# Altium project bdk2m_comm.PrjPcb
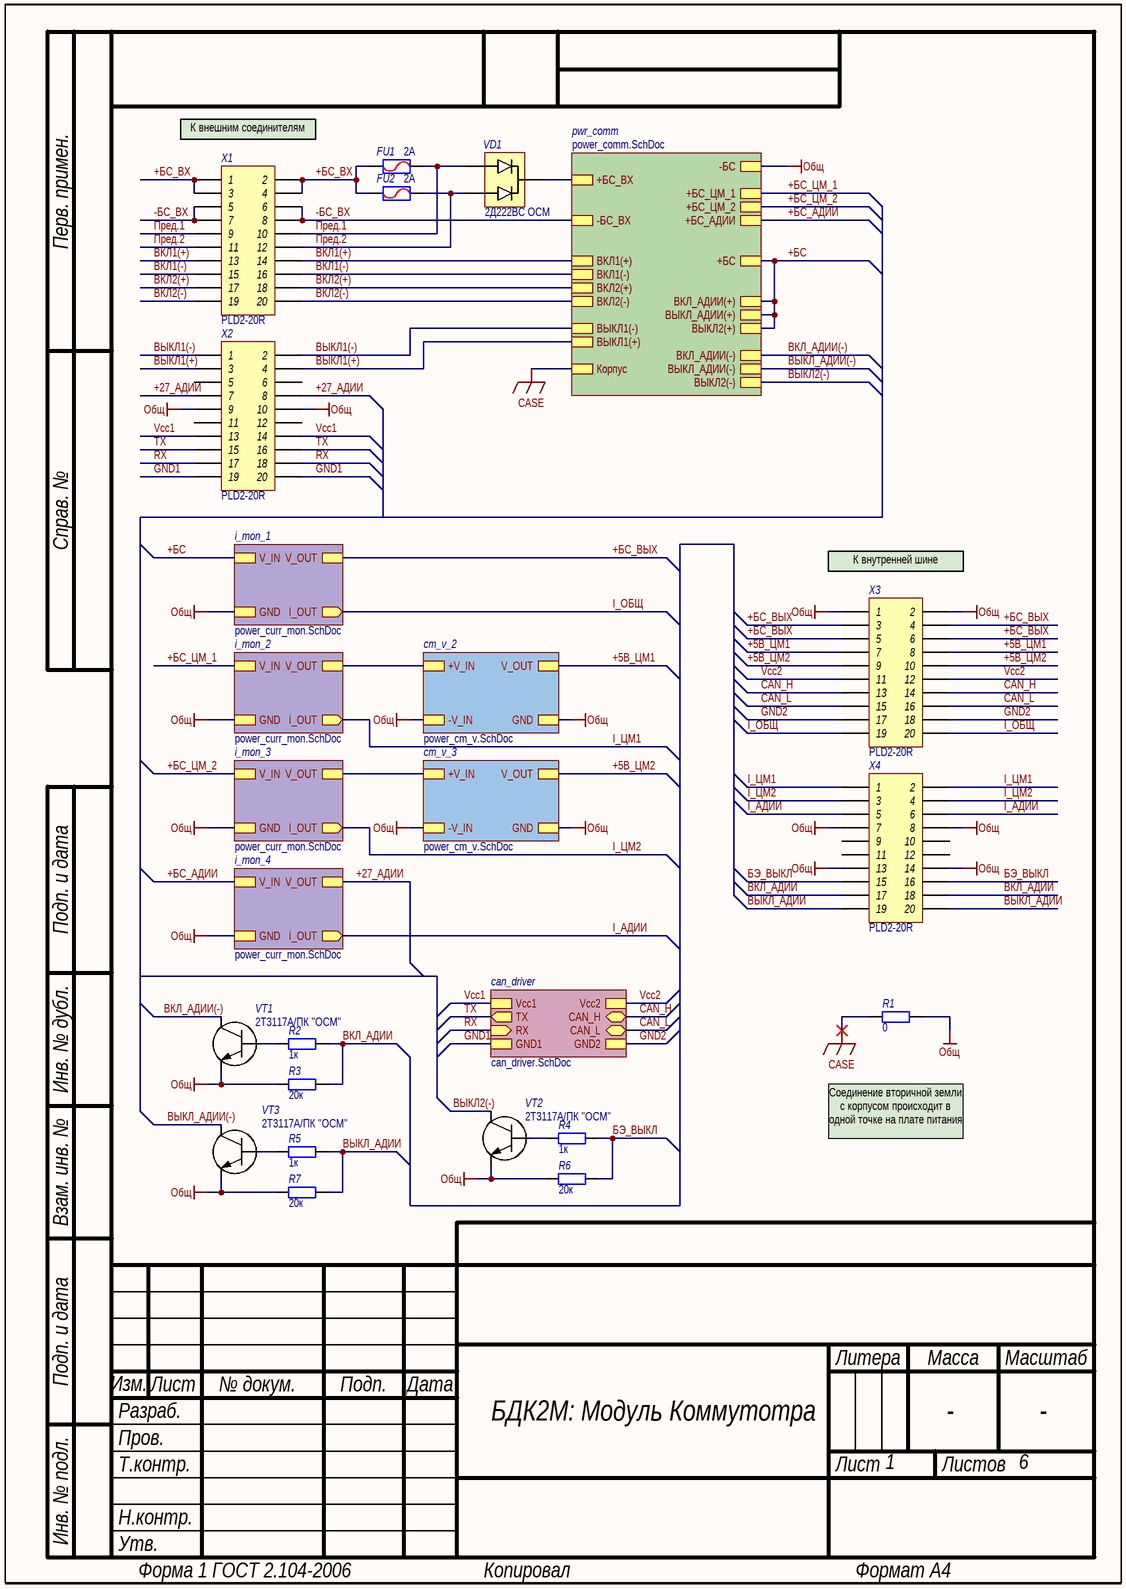
[diagram p0: bdk2m_comm.SchDoc]
GlobalOrganizationName: НГУ; GlobalProjectName: БДК2М: Модуль Коммутотра; GlobalProjectNumber: ЮМП.250.212.01; GlobalProjectRevision: #1.0; Норм.Контр.: Задорожная; Проверил: Прокопьев; Разработал: Стюф; Утвердил: Прокопьев
6 sheets, 91 parts. Net scope: hierarchical (ports join the sheet entries above them; power ports are global).
Board file: bdk2m_comm.PcbDoc
Sheets:
  bdk2m_comm.SchDoc
    pwr_comm = power_comm.SchDoc
      p_f = power_filter.SchDoc
    cm_v_2 = power_cm_v.SchDoc
    i_mon_2 = power_curr_mon.SchDoc
    i_mon_3 = power_curr_mon.SchDoc
    i_mon_1 = power_curr_mon.SchDoc
    i_mon_4 = power_curr_mon.SchDoc
    cm_v_3 = power_cm_v.SchDoc
    can_driver = can_driver.SchDoc

## Sheet bdk2m_comm.SchDoc: =GlobalProjectName
size 209 x 297 mm; ApprovedBy: Прокопьев; CheckedBy: Прокопьев; Author: Стюф; Organization: НГУ; DocumentNumber: ЮМП.250.212.01 Э3; Revision: #1.0; SheetNumber: 1; SheetTotal: 6; PageSetup: Record=PageOptions|CenterHorizontal=True|CenterVertical=True|PrintScale=1.00|XCorrection=1.00|YCorrection=1.00|PrintKind=1|BorderSize=5000000|LeftOffset=0|BottomOffset=0|Orientation=2|PaperLength=1000|PaperWidth=1000|Scale=100|PaperSource=15|PrintQuality=1200|MediaType=1|DitherType=10|PaperKind=A3|PrintScaleMode=1; Weight: -; ScaleFactor: -; NormInspection: Задорожная; FirstApplication: ЮМП.250.212.01; DocumentName: БДК2М: Модуль Коммутотра

### Parts
FU1  value 2A  [VP1-2]  (hidden comment: VP1-2)
FU2  value 2A  [VP1-2]  (hidden comment: VP1-2)
R1  0  [SMD_0805]
R2  1к  [SMD_0805]
R3  20к  [SMD_0805]
R4  1к  [SMD_0805]
R5  1к  [SMD_0805]
R6  20к  [SMD_0805]
R7  20к  [SMD_0805]
VD1  Наименование: 2Д222ВС ОСМ  [4116.4-3_offcut]  (hidden comment: 2D222VS "OSM")
VT1  Наименование: 2Т3117А/ПК "ОСМ"  [TO-18]  (hidden comment: 2T3117A)
VT2  Наименование: 2Т3117А/ПК "ОСМ"  [TO-18]  (hidden comment: 2T3117A)
VT3  Наименование: 2Т3117А/ПК "ОСМ"  [TO-18]  (hidden comment: 2T3117A)
X1  Header 2X10  [PLD2-20R]  (value not drawn)
X2  Header 2X10  [PLD2-20R]  (value not drawn)
X3  Header 2X10  [PLD2-20R]  (value not drawn)
X4  Header 2X10  [PLD2-20R]  (value not drawn)

### Sub-sheets
can_driver = can_driver.SchDoc: TX (out), CAN_H (bidir), Vcc2, GND2, Vcc1, CAN_L (bidir), RX (in), GND1
cm_v_2 = power_cm_v.SchDoc: GND, V_OUT, -V_IN, +V_IN
cm_v_3 = power_cm_v.SchDoc: GND, V_OUT, -V_IN, +V_IN
i_mon_1 = power_curr_mon.SchDoc: I_OUT (out), V_IN, V_OUT, GND
i_mon_2 = power_curr_mon.SchDoc: I_OUT (out), V_IN, V_OUT, GND
i_mon_3 = power_curr_mon.SchDoc: I_OUT (out), V_IN, V_OUT, GND
i_mon_4 = power_curr_mon.SchDoc: I_OUT (out), V_IN, V_OUT, GND
pwr_comm = power_comm.SchDoc: ВЫКЛ1(-), -БС, ВЫКЛ1(+), -БС_ВХ, ВКЛ1(+), ВКЛ2(-), +БС_ВХ, +БС_ЦМ_1, ВКЛ_АДИИ(+), ВЫКЛ2(-), ВКЛ2(+), ВКЛ1(-), +БС, +БС_АДИИ, ВЫКЛ_АДИИ(+), ВЫКЛ2(+), +БС_ЦМ_2, Корпус, ВКЛ_АДИИ(-), ВЫКЛ_АДИИ(-)

### Nets
CASE: R1.1 ; sheet pwr_comm/Корпус
Общ: R1.2 R3.1 R6.1 R7.1 VT1.1(EMITTER) VT2.1(EMITTER) VT3.1(EMITTER) X2.9 X2.10 X3.1 X3.2 X4.7 X4.8 X4.13 X4.14 ; sheet pwr_comm/-БС, sheet cm_v_2/GND, sheet cm_v_2/-V_IN, sheet i_mon_2/GND, sheet i_mon_3/GND, sheet i_mon_1/GND, sheet i_mon_4/GND, sheet cm_v_3/GND, sheet cm_v_3/-V_IN
+5В_ЦМ1: X3.7 X3.8 ; sheet cm_v_2/V_OUT
+5В_ЦМ2: X3.9 X3.10 ; sheet cm_v_3/V_OUT
+27_АДИИ: X2.7 X2.8 ; sheet i_mon_4/V_OUT
+V_IN: sheet cm_v_2/+V_IN, sheet i_mon_2/V_OUT
+V_IN: sheet i_mon_3/V_OUT, sheet cm_v_3/+V_IN  [a separate net that carries the same name]
+БС: sheet pwr_comm/ВКЛ_АДИИ(+), sheet pwr_comm/+БС, sheet pwr_comm/ВЫКЛ_АДИИ(+), sheet pwr_comm/ВЫКЛ2(+), sheet i_mon_1/V_IN
+БС_АДИИ: sheet pwr_comm/+БС_АДИИ, sheet i_mon_4/V_IN
+БС_ВХ: FU1.1 FU2.1 X1.1 X1.2 X1.3 X1.4
+БС_ВЫХ: X3.3 X3.4 X3.5 X3.6 ; sheet i_mon_1/V_OUT
+БС_ЦМ_1: sheet pwr_comm/+БС_ЦМ_1, sheet i_mon_2/V_IN
+БС_ЦМ_2: sheet pwr_comm/+БС_ЦМ_2, sheet i_mon_3/V_IN
-БС_ВХ: X1.5 X1.6 X1.7 X1.8 ; sheet pwr_comm/-БС_ВХ
CAN_H: X3.13 X3.14 ; sheet can_driver/CAN_H
CAN_L: X3.15 X3.16 ; sheet can_driver/CAN_L
GND1: X2.19 X2.20 ; sheet can_driver/GND1
GND2: X3.17 X3.18 ; sheet can_driver/GND2
I_АДИИ: X4.5 X4.6 ; sheet i_mon_4/I_OUT
I_ОБЩ: X3.19 X3.20 ; sheet i_mon_1/I_OUT
I_ЦМ1: X4.1 X4.2 ; sheet i_mon_2/I_OUT
I_ЦМ2: X4.3 X4.4 ; sheet i_mon_3/I_OUT
RX: X2.17 X2.18 ; sheet can_driver/RX
TX: X2.15 X2.16 ; sheet can_driver/TX
Vcc1: X2.13 X2.14 ; sheet can_driver/Vcc1
Vcc2: X3.11 X3.12 ; sheet can_driver/Vcc2
БЭ_ВЫКЛ: R4.2 R6.2 X4.15 X4.16
ВКЛ1(+): X1.13 X1.14 ; sheet pwr_comm/ВКЛ1(+)
ВКЛ1(-): X1.15 X1.16 ; sheet pwr_comm/ВКЛ1(-)
ВКЛ2(+): X1.17 X1.18 ; sheet pwr_comm/ВКЛ2(+)
ВКЛ2(-): X1.19 X1.20 ; sheet pwr_comm/ВКЛ2(-)
ВКЛ_АДИИ: R2.2 R3.2 X4.17 X4.18
ВКЛ_АДИИ(-): VT1.3(COLLECTOR) ; sheet pwr_comm/ВКЛ_АДИИ(-)
ВЫКЛ1(+): X2.3 X2.4 ; sheet pwr_comm/ВЫКЛ1(+)
ВЫКЛ1(-): X2.1 X2.2 ; sheet pwr_comm/ВЫКЛ1(-)
ВЫКЛ2(-): VT2.3(COLLECTOR) ; sheet pwr_comm/ВЫКЛ2(-)
ВЫКЛ_АДИИ: R5.2 R7.2 X4.19 X4.20
ВЫКЛ_АДИИ(-): VT3.3(COLLECTOR) ; sheet pwr_comm/ВЫКЛ_АДИИ(-)
Пред.1: FU1.2 VD1.11 X1.9 X1.10
Пред.2: FU2.2 VD1.17 X1.11 X1.12
NetK1_2: VD1.8 ; sheet pwr_comm/+БС_ВХ
NetR2_1: R2.1 VT1.2(BASE)
NetR4_1: R4.1 VT2.2(BASE)
NetR5_1: R5.1 VT3.2(BASE)

Not connected (* = marked no-connect by the designer): X2 5 6 11 12; X4 9 10 11 12

### Notes on the sheet
- (near X1) К внешним соединителям
- (near X3) К внутренней шине
- Соединение вторичной земли с корпусом происходит в одной точке на плате питания
- Перв. примен.
- Справ. №
- Подп. и дата
- Инв. № дубл.
- Взам. инв. №
- Разраб.
- Изм.
- Лист
- № докум.
- Подп.
- Дата
- Литера
- Масса
- Масштаб
- Пров.
- Т.контр.
- Листов
- Инв. № подл.
- Н.контр.
- Утв.
- Форма 1 ГОСТ 2.104-2006
- Копировал
- Формат А4

### Library data of the parts
FU1 FU2 = VP1-2: Предохранитель плавкий; Наименование: ВП1-2 "ВП"; Назначение: Предохранитель плавкий; ComponentLink1Description: DataSheet; ComponentLink1URL: https://docviewer.yandex.ru/view/20572601/?page=1&*=oYyHA%2BCwzeyRvrmOJV6%2ByaBlbHJ7InVybCI6Imh0dHBzOi8vZWwtcmEucnUvdXBsb2FkL2libG9jay8wMTYvdnN0YXZrYS1wbGF2a2EtdnAxXzItX2VsZWt0cm9uaWthX3JhXy5wZGYiLCJ0aXRsZSI6InZzdGF2a2EtcGxhdmthLXZwMV8yLV9lbGVrdHJvbmlrYV9yYV8ucGRmIiwibm9pZnJhbWUiOnRydWUsInVpZCI6IjIwNTcyNjAxIiwidHMiOjE1OTI0NzI0NTM1MTUsInl1IjoiODg5MDYxMzMxNTQzMzg3MTIxIiwic2VycFBhcmFtcyI6Imxhbmc9cnUmdG09MTU5MjQ3MjQyOCZ0bGQ9cnUmbmFtZT12c3RhdmthLXBsYXZrYS12cDFfMi1fZWxla3Ryb25pa2FfcmFfLnBkZiZ0ZXh0PSVEMCVCMiVEMCVCRjEtMiZ1cmw9aHR0cHMlM0EvL2VsLXJhLnJ1L3VwbG9hZC9pYmxvY2svMDE2L3ZzdGF2a2EtcGxhdmthLXZwMV8yLV9lbGVrdHJvbmlrYV9yYV8ucGRmJmxyPTY1Jm1pbWU9cGRmJmwxMG49cnUmc2lnbj0yZWMwNDRiZDQyMGRlMjRmMjI1MThkNTc4YjZlMTlkYiZrZXlubz0wIn0%3D&lang=ru
R1-R7 = Resistor: Наименование: Резистор; Назначение: SMD-резистор; Потребление, Вт: 0,001
  R1: Value: 0
  R2 R4 R5: Value: 1к
  R3 R6 R7: Value: 20к
VD1 = 2D222: Сдвоенный диод; Потребление, Вт: 0,004; Назначение: Сдвоенный диод; ComponentLink1Description: DataSheet; ComponentLink1URL: https://eandc.ru/pdf/diod/2d222.pdf
VT1-VT3 = 2T3117A: Кремниевый биполярный / эпитаксиально-планарный / n-p-n транзистор; Назначение: Биполярный транзистор; Потребление, Вт: 0,0; ComponentLink1Description: DataSheet; ComponentLink1URL: https://www.integral.by/sites/default/files/pdf/2t3117.pdf
X1-X4 = PLD2-20: Header, 12-Pin, Dual row; Назначение: Header, 20-Pin, Dual row; Потребление, Вт: 0,0; Наименование: PLD2-20R

## Sheet power_comm.SchDoc: =GlobalProjectName
size 209 x 297 mm; ApprovedBy: Утвердил; CheckedBy: Проверил; Author: Разработал; Organization: НГУ; DocumentNumber: ЮМП.250.212.01 Э3; Revision: #1.0; SheetNumber: 3; SheetTotal: 6; PageSetup: Record=PageOptions|CenterHorizontal=True|CenterVertical=True|PrintScale=1.00|XCorrection=1.00|YCorrection=1.00|PrintKind=1|BorderSize=5000000|LeftOffset=0|BottomOffset=0|Orientation=2|PaperLength=1000|PaperWidth=1000|Scale=100|PaperSource=15|PrintQuality=1200|MediaType=1|DitherType=10|PaperKind=A3|PrintScaleMode=1; Weight: -; ScaleFactor: -; NormInspection: Норм.Контр.; FirstApplication: ЮМП.250.212.01; DocumentName: БДК2М: Модуль Коммутотра
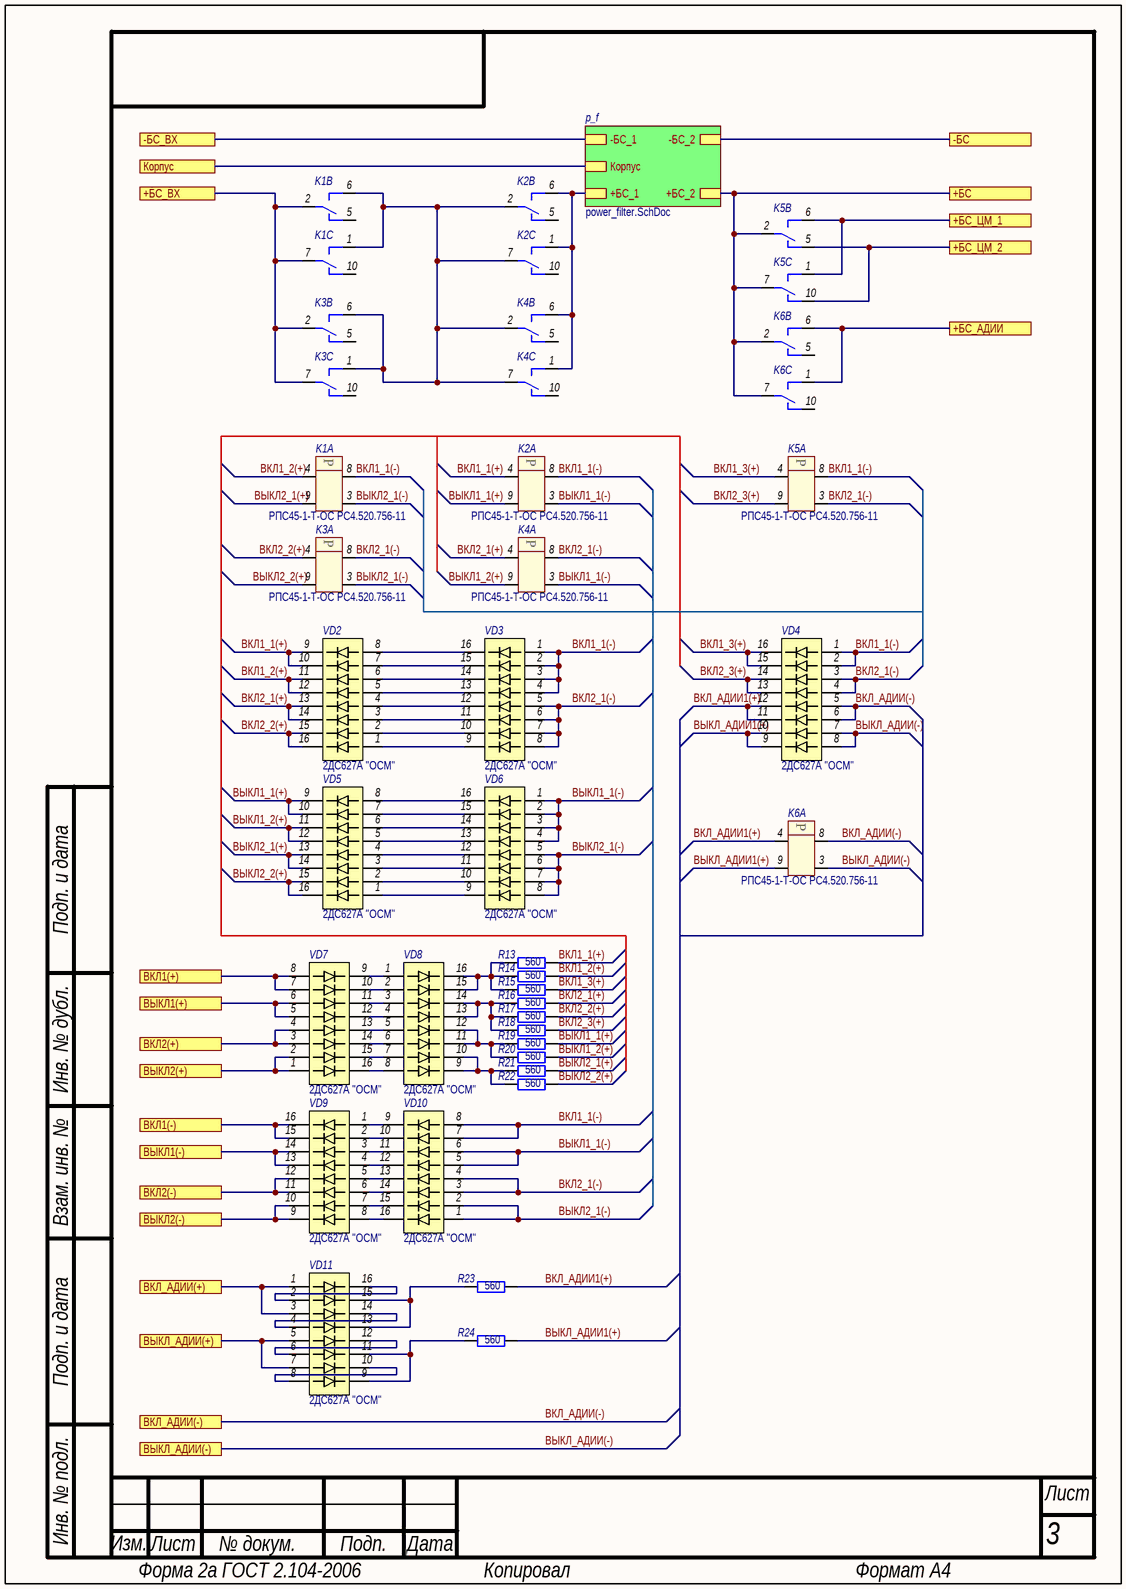
[diagram p1: power_comm.SchDoc]

### Parts
K1  Наименование: РПС45-1-Т-ОС РС4.520.756-11  [RPS-45-1]  (hidden comment: RPS45-1-T-OS)  (parts A,B,C of 3)
K2  Наименование: РПС45-1-Т-ОС РС4.520.756-11  [RPS-45-1]  (hidden comment: RPS45-1-T-OS)  (parts A,B,C of 3)
K3  Наименование: РПС45-1-Т-ОС РС4.520.756-11  [RPS-45-1]  (hidden comment: RPS45-1-T-OS)  (parts A,B,C of 3)
K4  Наименование: РПС45-1-Т-ОС РС4.520.756-11  [RPS-45-1]  (hidden comment: RPS45-1-T-OS)  (parts A,B,C of 3)
K5  Наименование: РПС45-1-Т-ОС РС4.520.756-11  [RPS-45-1]  (hidden comment: RPS45-1-T-OS)  (parts A,B,C of 3)
K6  Наименование: РПС45-1-Т-ОС РС4.520.756-11  [RPS-45-1]  (hidden comment: RPS45-1-T-OS)  (parts A,B,C of 3)
R13  560  [SMD_0805]
R14  560  [SMD_0805]
R15  560  [SMD_0805]
R16  560  [SMD_0805]
R17  560  [SMD_0805]
R18  560  [SMD_0805]
R19  560  [SMD_0805]
R20  560  [SMD_0805]
R21  560  [SMD_0805]
R22  560  [SMD_0805]
R23  560  [SMD_0805]
R24  560  [SMD_0805]
VD2  Наименование: 2ДС627А "ОСМ"  [401.16-3]  (hidden comment: 2DS627A OSM)
VD3  Наименование: 2ДС627А "ОСМ"  [401.16-3]  (hidden comment: 2DS627A OSM)
VD4  Наименование: 2ДС627А "ОСМ"  [401.16-3]  (hidden comment: 2DS627A OSM)
VD5  Наименование: 2ДС627А "ОСМ"  [401.16-3]  (hidden comment: 2DS627A OSM)
VD6  Наименование: 2ДС627А "ОСМ"  [401.16-3]  (hidden comment: 2DS627A OSM)
VD7  Наименование: 2ДС627А "ОСМ"  [401.16-3]  (hidden comment: 2DS627A OSM)
VD8  Наименование: 2ДС627А "ОСМ"  [401.16-3]  (hidden comment: 2DS627A OSM)
VD9  Наименование: 2ДС627А "ОСМ"  [401.16-3]  (hidden comment: 2DS627A OSM)
VD10  Наименование: 2ДС627А "ОСМ"  [401.16-3]  (hidden comment: 2DS627A OSM)
VD11  Наименование: 2ДС627А "ОСМ"  [401.16-3]  (hidden comment: 2DS627A OSM)

### Sub-sheets
p_f = power_filter.SchDoc: +БС_2, Корпус, -БС_2, +БС_1, -БС_1

### Ports
+БС, +БС_АДИИ, +БС_ВХ, +БС_ЦМ_1, +БС_ЦМ_2, -БС, -БС_ВХ, ВКЛ1(+), ВКЛ1(-), ВКЛ2(+), ВКЛ2(-), ВКЛ_АДИИ(+), ВКЛ_АДИИ(-), ВЫКЛ1(+), ВЫКЛ1(-), ВЫКЛ2(+), ВЫКЛ2(-), ВЫКЛ_АДИИ(+), ВЫКЛ_АДИИ(-), Корпус

### Nets
CASE: port Корпус, sheet p_f/Корпус
Общ: port -БС, sheet p_f/-БС_2
+БС: K5.2 K5.7 K6.2 K6.7 VD7.1(1A) VD7.2(1B) VD11.1(1A) VD11.3(1C) VD11.5(1E) VD11.7(1G) ; port +БС, port ВЫКЛ2(+), port ВКЛ_АДИИ(+), port ВЫКЛ_АДИИ(+), sheet p_f/+БС_2
+БС_1: K2.1 K2.6 K4.1 K4.6 ; sheet p_f/+БС_1
+БС_АДИИ: K6.1 K6.6 ; port +БС_АДИИ
+БС_ЦМ_1: K5.1 K5.6 ; port +БС_ЦМ_1
+БС_ЦМ_2: K5.5 K5.10 ; port +БС_ЦМ_2
-БС_ВХ: port -БС_ВХ, sheet p_f/-БС_1
ВКЛ1(+): VD7.7(1G) VD7.8(1H) ; port ВКЛ1(+)
ВКЛ1(-): VD9.15(2B) VD9.16(2A) ; port ВКЛ1(-)
ВКЛ1_1(+): K2.4 R13.2 VD2.9(2G) VD2.10(2G)
ВКЛ1_1(-): K1.8 K2.8 K5.8 VD3.1(1A) VD3.2(1B) VD3.3(1C) VD3.4(1D) VD4.1(1A) VD4.2(1B) VD10.7(1G) VD10.8(1H)
ВКЛ1_2(+): K1.4 R14.2 VD2.11(2F) VD2.12(2E)
ВКЛ1_3(+): K5.4 R15.2 VD4.15(2B) VD4.16(2A)
ВКЛ2(+): VD7.3(1C) VD7.4(1D) ; port ВКЛ2(+)
ВКЛ2(-): VD9.11(2F) VD9.12(2E) ; port ВКЛ2(-)
ВКЛ2_1(+): K4.4 R16.2 VD2.13(2D) VD2.14(2C)
ВКЛ2_1(-): K3.8 K4.8 K5.3 VD3.5(1E) VD3.6(1F) VD3.7(1G) VD3.8(1H) VD4.3(1C) VD4.4(1D) VD10.3(1C) VD10.4(1D)
ВКЛ2_2(+): K3.4 R17.2 VD2.15(2B) VD2.16(2A)
ВКЛ2_3(+): K5.9 R18.2 VD4.13(2D) VD4.14(2C)
ВКЛ_АДИИ1(+): K6.4 R23.2 VD4.11(2F) VD4.12(2E)
ВКЛ_АДИИ(-): K6.8 VD4.5(1E) VD4.6(1F) ; port ВКЛ_АДИИ(-)
ВЫКЛ1(+): VD7.5(1E) VD7.6(1F) ; port ВЫКЛ1(+)
ВЫКЛ1(-): VD9.13(2D) VD9.14(2C) ; port ВЫКЛ1(-)
ВЫКЛ1_1(+): K2.9 R19.2 VD5.9(2G) VD5.10(2G)
ВЫКЛ1_1(-): K2.3 K4.3 VD6.1(1A) VD6.2(1B) VD6.3(1C) VD6.4(1D) VD10.5(1E) VD10.6(1F)
ВЫКЛ1_2(+): K4.9 R20.2 VD5.11(2F) VD5.12(2E)
ВЫКЛ2(-): VD9.9(2G) VD9.10(2G) ; port ВЫКЛ2(-)
ВЫКЛ2_1(+): K1.9 R21.2 VD5.13(2D) VD5.14(2C)
ВЫКЛ2_1(-): K1.3 K3.3 VD6.5(1E) VD6.6(1F) VD6.7(1G) VD6.8(1H) VD10.1(1A) VD10.2(1B)
ВЫКЛ2_2(+): K3.9 R22.2 VD5.15(2B) VD5.16(2A)
ВЫКЛ_АДИИ1(+): K6.9 R24.2 VD4.9(2G) VD4.10(2G)
ВЫКЛ_АДИИ(-): K6.3 VD4.7(1G) VD4.8(1H) ; port ВЫКЛ_АДИИ(-)
NetK1_1: K1.1 K1.6 K2.2 K2.7 K3.1 K3.6 K4.2 K4.7
NetK1_2: K1.2 K1.7 K3.2 K3.7 ; port +БС_ВХ
NetR13_1: R13.1 R14.1 R15.1 VD8.15(2B) VD8.16(2A)
NetR16_1: R16.1 R17.1 R18.1 VD8.13(2D) VD8.14(2C)
NetR19_1: R19.1 R20.1 VD8.11(2F) VD8.12(2E)
NetR21_1: R21.1 R22.1 VD8.9(2G) VD8.10(2G)
NetR23_1: R23.1 VD11.13(2D) VD11.15(2B)
NetR24_1: R24.1 VD11.9(2G) VD11.11(2F)
NetVD2_1: VD2.1(1A) VD3.9(2G)
NetVD2_2: VD2.2(1B) VD3.10(2G)
NetVD2_3: VD2.3(1C) VD3.11(2F)
NetVD2_4: VD2.4(1D) VD3.12(2E)
NetVD2_5: VD2.5(1E) VD3.13(2D)
NetVD2_6: VD2.6(1F) VD3.14(2C)
NetVD2_7: VD2.7(1G) VD3.15(2B)
NetVD2_8: VD2.8(1H) VD3.16(2A)
NetVD5_1: VD5.1(1A) VD6.9(2G)
NetVD5_2: VD5.2(1B) VD6.10(2G)
NetVD5_3: VD5.3(1C) VD6.11(2F)
NetVD5_4: VD5.4(1D) VD6.12(2E)
NetVD5_5: VD5.5(1E) VD6.13(2D)
NetVD5_6: VD5.6(1F) VD6.14(2C)
NetVD5_7: VD5.7(1G) VD6.15(2B)
NetVD5_8: VD5.8(1H) VD6.16(2A)
NetVD7_9: VD7.9(2G) VD8.1(1A)
NetVD7_10: VD7.10(2G) VD8.2(1B)
NetVD7_11: VD7.11(2F) VD8.3(1C)
NetVD7_12: VD7.12(2E) VD8.4(1D)
NetVD7_13: VD7.13(2D) VD8.5(1E)
NetVD7_14: VD7.14(2C) VD8.6(1F)
NetVD7_15: VD7.15(2B) VD8.7(1G)
NetVD7_16: VD7.16(2A) VD8.8(1H)
NetVD9_1: VD9.1(1A) VD10.9(2G)
NetVD9_2: VD9.2(1B) VD10.10(2G)
NetVD9_3: VD9.3(1C) VD10.11(2F)
NetVD9_4: VD9.4(1D) VD10.12(2E)
NetVD9_5: VD9.5(1E) VD10.13(2D)
NetVD9_6: VD9.6(1F) VD10.14(2C)
NetVD9_7: VD9.7(1G) VD10.15(2B)
NetVD9_8: VD9.8(1H) VD10.16(2A)
NetVD11_2: VD11.2(1B) VD11.16(2A)
NetVD11_4: VD11.4(1D) VD11.14(2C)
NetVD11_6: VD11.6(1F) VD11.12(2E)
NetVD11_8: VD11.8(1H) VD11.10(2G)

Not connected (* = marked no-connect by the designer): K1 5 10; K2 5 10; K3 5 10; K4 5 10; K6 5 10

### Notes on the sheet
- Подп. и дата
- Инв. № дубл.
- Взам. инв. №
- Инв. № подл.
- Изм.
- Лист
- № докум.
- Подп.
- Дата
- Форма 2а ГОСТ 2.104-2006
- Копировал
- Формат А4
- (in symbol RPS45, part A) P

### Library data of the parts
K1-K6 = RPS45: Реле поляризованное; Потребление, Вт: 0,000; Назначение: Реле поляризованное; ComponentLink1Description: DataSheet; ComponentLink1URL: https://relays.ru/files/catalog/rps45.pdf
R13-R24 = Resistor: as R1 on sheet bdk2m_comm; Value: 560
VD2-VD11 = 2DS627A: Диодная матрица; Потребление, Вт: 0,0; Назначение: Диодная матрица; ComponentLink1Description: DataSheet; ComponentLink1URL: https://www.integral.by/sites/default/files/pdf/2ds627a.pdf

## Sheet power_filter.SchDoc: =GlobalProjectName
size 209 x 297 mm; ApprovedBy: Утвердил; CheckedBy: Проверил; Author: Разработал; Organization: НГУ; DocumentNumber: ЮМП.250.212.01 Э3; Revision: #1.0; SheetNumber: 2; SheetTotal: 6; PageSetup: Record=PageOptions|CenterHorizontal=True|CenterVertical=True|PrintScale=1.00|XCorrection=1.00|YCorrection=1.00|PrintKind=1|BorderSize=5000000|LeftOffset=0|BottomOffset=0|Orientation=2|PaperLength=1000|PaperWidth=1000|Scale=100|PaperSource=15|PrintQuality=1200|MediaType=1|DitherType=10|PaperKind=A3|PrintScaleMode=1; Weight: -; ScaleFactor: -; NormInspection: Норм.Контр.; FirstApplication: ЮМП.250.212.01; DocumentName: БДК2М: Модуль Коммутотра
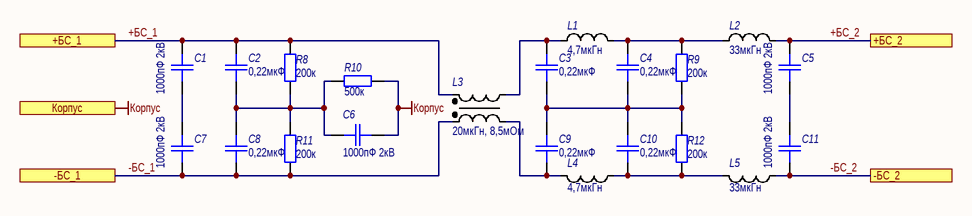
[diagram p2: power_filter.SchDoc]

### Parts
C1  1000пФ 2кВ  [SMD_1206]
C2  0,22мкФ  [SMD_0805]
C3  0,22мкФ  [SMD_0805]
C4  0,22мкФ  [SMD_0805]
C5  1000пФ 2кВ  [SMD_1206]
C6  1000пФ 2кВ  [SMD_1206]
C7  1000пФ 2кВ  [SMD_1206]
C8  0,22мкФ  [SMD_0805]
C9  0,22мкФ  [SMD_0805]
C10  0,22мкФ  [SMD_0805]
C11  1000пФ 2кВ  [SMD_1206]
L1  4,7мкГн  [SMD_0805]
L2  33мкГн  [SMD_size_B]
L3  20мкГн, 8,5мОм  [PLT10HH]
L4  4,7мкГн  [SMD_0805]
L5  33мкГн  [SMD_size_B]
R8  200к  [SMD_0805]
R9  200к  [SMD_0805]
R10  500к  [SMD_0805]
R11  200к  [SMD_0805]
R12  200к  [SMD_0805]

### Ports
+БС_1, +БС_2, -БС_1, -БС_2, Корпус

### Nets
-БС_2: C11.2 L5.1 ; port -БС_2  [project net Общ]
Корпус: C6.1 R10.2 ; port Корпус  [project net CASE]
+БС_1: C1.1 C2.2 L3.3 R8.2 ; port +БС_1
+БС_2: C5.1 L2.2 ; port +БС_2  [project net +БС]
-БС_1: C7.2 C8.1 L3.2 R11.1 ; port -БС_1  [project net -БС_ВХ]
NetC1_2: C1.2 C7.1
NetC2_1: C2.1 C6.2 C8.2 R8.1 R10.1 R11.2
NetC3_1: C3.1 C4.1 C9.2 C10.2 R9.1 R12.2
NetC3_2: C3.2 L1.1 L3.4
NetC4_2: C4.2 L1.2 L2.1 R9.2
NetC5_2: C5.2 C11.1
NetC9_1: C9.1 L3.1 L4.2
NetC10_1: C10.1 L4.1 L5.2 R12.1

### Notes on the sheet
- Подп. и дата
- Инв. № дубл.
- Взам. инв. №
- Инв. № подл.
- Изм.
- Лист
- № докум.
- Подп.
- Дата
- Форма 2а ГОСТ 2.104-2006
- Копировал
- Формат А4

### Library data of the parts
C1-C11 = Capacitor: Назначение: SMD-конденсатор; Наименование: Конденсатор; Потребление, Вт: 0
  C1 C5-C7 C11: Value: 1000пФ 2кВ
  C2-C4 C8-C10: Value: 0,22мкФ
L1 L2 L4 L5 = Inductor: Наименование: Индуктивность; Назначение: SMD-индуктивность; Потребление, Вт: 0,010
  L1 L4: Value: 4,7мкГн
  L2 L5: Value: 33мкГн
L3 = Inductor_coupled: Coupled inductor; Назначение: Связанная индуктивность; Наименование: PLT10HH1026R0PN; Потребление, Вт: 0,1; Value: 20мкГн, 8,5мОм
R8-R12 = Resistor: as R1 on sheet bdk2m_comm
  R8 R9 R11 R12: Value: 200к
  R10: Value: 500к

## Sheet power_cm_v.SchDoc: =GlobalProjectName
size 209 x 297 mm; ApprovedBy: Прокопьев; CheckedBy: Прокопьев; Author: Стюф; Organization: НГУ; DocumentNumber: ЮМП.250.212.01 Э3; Revision: #1.0; SheetNumber: 4; SheetTotal: 6; PageSetup: Record=PageOptions|CenterHorizontal=True|CenterVertical=True|PrintScale=1.00|XCorrection=1.00|YCorrection=1.00|PrintKind=1|BorderSize=5000000|LeftOffset=0|BottomOffset=0|Orientation=2|PaperLength=1000|PaperWidth=1000|Scale=100|PaperSource=15|PrintQuality=1200|MediaType=1|DitherType=10|PaperKind=A3|PrintScaleMode=1; Weight: -; ScaleFactor: -; NormInspection: Задорожная; FirstApplication: ЮМП.250.212.01; DocumentName: БДК2М: Модуль Коммутотра
Used 2 times, as channels cm_v_2, cm_v_3. Parts and nets are listed once, with the designators drawn on the sheet.
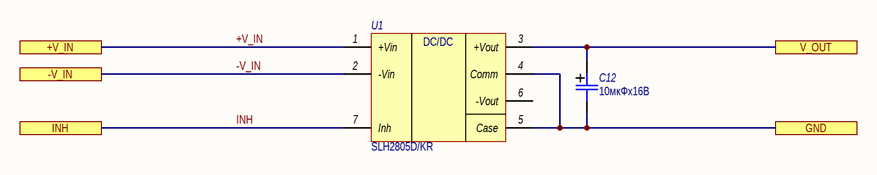
[diagram p3: power_cm_v.SchDoc]

### Parts
C12  10мкФх16В  [SMD_size_B]
U1  Наименование: SLH2805D/KR  [SLH28xx]  (hidden comment: SLH28xx)

### Ports
+V_IN, -V_IN, GND, INH, V_OUT

### Nets
+V_IN: U1.1(+Vin) ; port +V_IN
-V_IN: U1.2(-Vin) ; port -V_IN
GND: C12.2 U1.4(Comm) U1.5(Case) ; port GND
INH: U1.7(Inh) ; port INH
V_OUT: C12.1 U1.3(+Vout) ; port V_OUT

Not connected (* = marked no-connect by the designer): U1 6(-Vout)

### Channels
cm_v_2: designators end in _cm_v_2; ports +V_IN=+V_IN -V_IN=Общ GND=Общ INH=INH_cm_v_2 V_OUT=+5В_ЦМ1
cm_v_3: designators end in _cm_v_3; ports +V_IN=+V_IN -V_IN=Общ GND=Общ INH=INH_cm_v_3 V_OUT=+5В_ЦМ2

### Notes on the sheet
- Подп. и дата
- Инв. № дубл.
- Взам. инв. №
- Инв. № подл.
- Изм.
- Лист
- № докум.
- Подп.
- Дата
- Форма 2а ГОСТ 2.104-2006
- Копировал
- Формат А4
- (in symbol SLH28xx) DC/DC

### Library data of the parts
C12 = Capacitor_pol: Polarized capacitor; Назначение: Поляризованный SMD-конденсатор; Наименование: Поляризованный конденсатор; Потребление, Вт: 0; Value: 10мкФх16В
U1 = SLH28xx: DC-DC; Назначение: DC-DC преобразователь; Потребление, Вт: 0.1; ComponentLink1Description: DataSheet; ComponentLink1URL: https://www.interpoint.com/product_documents/SLH_Space_DC_DC_Converters.pdf

## Sheet power_curr_mon.SchDoc: =GlobalProjectName
size 209 x 297 mm; ApprovedBy: Прокопьев; CheckedBy: Прокопьев; Author: Стюф; Organization: НГУ; DocumentNumber: ЮМП.250.212.01 Э3; Revision: #1.0; SheetNumber: 5; SheetTotal: 6; PageSetup: Record=PageOptions|CenterHorizontal=True|CenterVertical=True|PrintScale=1.00|XCorrection=1.00|YCorrection=1.00|PrintKind=1|BorderSize=5000000|LeftOffset=0|BottomOffset=0|Orientation=2|PaperLength=1000|PaperWidth=1000|Scale=100|PaperSource=15|PrintQuality=1200|MediaType=1|DitherType=10|PaperKind=A3|PrintScaleMode=1; Weight: -; ScaleFactor: -; NormInspection: Задорожная; FirstApplication: ЮМП.250.212.01; DocumentName: БДК2М: Модуль Коммутотра
Used 4 times, as channels i_mon_2, i_mon_3, i_mon_1, i_mon_4. Parts and nets are listed once, with the designators drawn on the sheet.
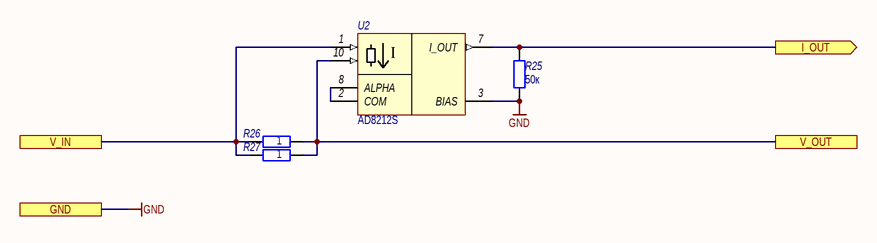
[diagram p4: power_curr_mon.SchDoc]

### Parts
R25  50к  [SMD_0805]
R26  1  [SMD_1206]
R27  1  [SMD_1206]
U2  AD8212S  [FlatPack-10_MSOP-8]

### Ports
GND, I_OUT (out), V_IN, V_OUT

### Nets
GND: R25.1 U2.3(BIAS) ; port GND
I_OUT: R25.2 U2.7(I_OUT) ; port I_OUT
V_IN: R26.1 R27.1 U2.1(V+) ; port V_IN
V_OUT: R26.2 R27.2 U2.10(V_SENSE) ; port V_OUT
NetU2_2: U2.2(COM) U2.8(ALPHA)

### Channels
i_mon_2: designators end in _i_mon_2; ports GND=Общ I_OUT=I_ЦМ1 V_IN=+БС_ЦМ_1 V_OUT=+V_IN
i_mon_3: designators end in _i_mon_3; ports GND=Общ I_OUT=I_ЦМ2 V_IN=+БС_ЦМ_2 V_OUT=+V_IN
i_mon_1: designators end in _i_mon_1; ports GND=Общ I_OUT=I_ОБЩ V_IN=+БС V_OUT=+БС_ВЫХ
i_mon_4: designators end in _i_mon_4; ports GND=Общ I_OUT=I_АДИИ V_IN=+БС_АДИИ V_OUT=+27_АДИИ

### Notes on the sheet
- Подп. и дата
- Инв. № дубл.
- Взам. инв. №
- Инв. № подл.
- Изм.
- Лист
- № докум.
- Подп.
- Дата
- Форма 2а ГОСТ 2.104-2006
- Копировал
- Формат А4
- (in symbol AD8212S) I

### Library data of the parts
R25-R27 = Resistor: as R1 on sheet bdk2m_comm
  R25: Value: 50к
  R26 R27: Value: 1
U2 = AD8212S: Назначение: Токовый датчик; Наименование: AD8212S

## Sheet can_driver.SchDoc: =GlobalProjectName
size 209 x 297 mm; ApprovedBy: Прокопьев; CheckedBy: Прокопьев; Author: Стюф; Organization: НГУ; DocumentNumber: ЮМП.250.212.01 Э3; Revision: #1.0; SheetNumber: 6; SheetTotal: 6; PageSetup: Record=PageOptions|CenterHorizontal=True|CenterVertical=True|PrintScale=1.00|XCorrection=1.00|YCorrection=1.00|PrintKind=1|BorderSize=5000000|LeftOffset=0|BottomOffset=0|Orientation=2|PaperLength=1000|PaperWidth=1000|Scale=100|PaperSource=15|PrintQuality=1200|MediaType=1|DitherType=10|PaperKind=A3|PrintScaleMode=1; Weight: -; ScaleFactor: -; NormInspection: Задорожная; FirstApplication: ЮМП.250.212.01; DocumentName: БДК2М: Модуль Коммутотра
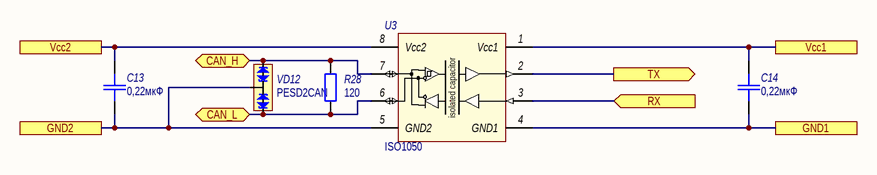
[diagram p5: can_driver.SchDoc]

### Parts
C13  0,22мкФ  [SMD_0805]
C14  0,22мкФ  [SMD_0805]
R28  120  [SMD_0805]
U3  ISO1050  [SOP-8]
VD12  PESD2CAN  [SOT-23]

### Ports
CAN_H (bidir), CAN_L (bidir), GND1, GND2, RX (in), TX (out), Vcc1, Vcc2

### Nets
CAN_H: R28.2 U3.7(ch) VD12.1(C1) ; port CAN_H
CAN_L: R28.1 U3.6(cl) VD12.2(C2) ; port CAN_L
GND1: C14.1 U3.4(GND1) ; port GND1
GND2: C13.1 U3.5(GND2) VD12.3(CC) ; port GND2
RX: U3.3(TXD) ; port RX
TX: U3.2(RXD) ; port TX
Vcc1: C14.2 U3.1(Vcc1) ; port Vcc1
Vcc2: C13.2 U3.8(Vcc2) ; port Vcc2

### Notes on the sheet
- Подп. и дата
- Инв. № дубл.
- Взам. инв. №
- Инв. № подл.
- Изм.
- Лист
- № докум.
- Подп.
- Дата
- Форма 2а ГОСТ 2.104-2006
- Копировал
- Формат А4
- (in symbol ISO1050) isolated capacitor

### Library data of the parts
C13 C14 = Capacitor: as C1 on sheet power_filter; Value: 0,22мкФ
R28 = Resistor: as R1 on sheet bdk2m_comm; Value: 120
U3 = ISO1050: Isolated CAN Transceiver; Назначение: Изолированный CAN приемник; Потребление, Вт: 0,001; ComponentLink1Description: Datasheet; ComponentLink1URL: http://www.ti.com/lit/ds/symlink/iso1050.pdf; Наименование: ISO1050
VD12 = PESD2CAN: CAN bus ESD protection diode; Назначение: Защитная диодная сборка CAN-шины от ЭСР; Потребление, Вт: 0,001; ComponentLink1Description: DataSheet; ComponentLink1URL: https://docviewer.yandex.ru/view/20572601/?*=RQqn8Wj9g8uNyA%2Fh5vLXNATrwhl7InVybCI6Imh0dHBzOi8vYXNzZXRzLm5leHBlcmlhLmNvbS9kb2N1bWVudHMvZGF0YS1zaGVldC9QRVNEMkNBTi5wZGYiLCJ0aXRsZSI6IlBFU0QyQ0FOLnBkZiIsIm5vaWZyYW1lIjp0cnVlLCJ1aWQiOiIyMDU3MjYwMSIsInRzIjoxNTk2Nzk0OTE4Njc4LCJ5dSI6Ijg4OTA2MTMzMTU0MzM4NzEyMSIsInNlcnBQYXJhbXMiOiJsYW5nPWVuJnRtPTE1OTY3OTQ4OTAmdGxkPXJ1Jm5hbWU9UEVTRDJDQU4ucGRmJnRleHQ9cGVzZDJjYW4mdXJsPWh0dHBzJTNBLy9hc3NldHMubmV4cGVyaWEuY29tL2RvY3VtZW50cy9kYXRhLXNoZWV0L1BFU0QyQ0FOLnBkZiZscj02NSZtaW1lPXBkZiZsMTBuPXJ1JnNpZ249MzE3ZjE4NzU1MTcwMWNmYmI4ZDQxYzc2OTNlYTFkYzIma2V5bm89MCJ9&lang=en; Наименование: PESD2CAN

## Nets that join several sheets
CASE: bdk2m_comm (R1.1), power_filter (C6.1 R10.2)
Общ: bdk2m_comm (15 pins), power_filter (C11.2 L5.1), cm_v_2 (C12_cm_v_2.2 U1_cm_v_2.2 U1_cm_v_2.4 U1_cm_v_2.5), i_mon_2 (R25_i_mon_2.1 U2_i_mon_2.3), i_mon_3 (R25_i_mon_3.1 U2_i_mon_3.3), i_mon_1 (R25_i_mon_1.1 U2_i_mon_1.3), i_mon_4 (R25_i_mon_4.1 U2_i_mon_4.3), cm_v_3 (C12_cm_v_3.2 U1_cm_v_3.2 U1_cm_v_3.4 U1_cm_v_3.5)
+5В_ЦМ1: bdk2m_comm (X3.7 X3.8), cm_v_2 (C12_cm_v_2.1 U1_cm_v_2.3)
+5В_ЦМ2: bdk2m_comm (X3.9 X3.10), cm_v_3 (C12_cm_v_3.1 U1_cm_v_3.3)
+27_АДИИ: bdk2m_comm (X2.7 X2.8), i_mon_4 (R26_i_mon_4.2 R27_i_mon_4.2 U2_i_mon_4.10)
+V_IN: cm_v_2 (U1_cm_v_2.1), i_mon_2 (R26_i_mon_2.2 R27_i_mon_2.2 U2_i_mon_2.10)
+V_IN: i_mon_3 (R26_i_mon_3.2 R27_i_mon_3.2 U2_i_mon_3.10), cm_v_3 (U1_cm_v_3.1)
+БС: power_comm (10 pins), power_filter (C5.1 L2.2), i_mon_1 (R26_i_mon_1.1 R27_i_mon_1.1 U2_i_mon_1.1)
+БС_1: power_comm (K2.1 K2.6 K4.1 K4.6), power_filter (C1.1 C2.2 L3.3 R8.2)
+БС_АДИИ: power_comm (K6.1 K6.6), i_mon_4 (R26_i_mon_4.1 R27_i_mon_4.1 U2_i_mon_4.1)
+БС_ВЫХ: bdk2m_comm (X3.3 X3.4 X3.5 X3.6), i_mon_1 (R26_i_mon_1.2 R27_i_mon_1.2 U2_i_mon_1.10)
+БС_ЦМ_1: power_comm (K5.1 K5.6), i_mon_2 (R26_i_mon_2.1 R27_i_mon_2.1 U2_i_mon_2.1)
+БС_ЦМ_2: power_comm (K5.5 K5.10), i_mon_3 (R26_i_mon_3.1 R27_i_mon_3.1 U2_i_mon_3.1)
-БС_ВХ: bdk2m_comm (X1.5 X1.6 X1.7 X1.8), power_filter (C7.2 C8.1 L3.2 R11.1)
CAN_H: bdk2m_comm (X3.13 X3.14), can_driver (R28.2 U3.7 VD12.1)
CAN_L: bdk2m_comm (X3.15 X3.16), can_driver (R28.1 U3.6 VD12.2)
GND1: bdk2m_comm (X2.19 X2.20), can_driver (C14.1 U3.4)
GND2: bdk2m_comm (X3.17 X3.18), can_driver (C13.1 U3.5 VD12.3)
I_АДИИ: bdk2m_comm (X4.5 X4.6), i_mon_4 (R25_i_mon_4.2 U2_i_mon_4.7)
I_ОБЩ: bdk2m_comm (X3.19 X3.20), i_mon_1 (R25_i_mon_1.2 U2_i_mon_1.7)
I_ЦМ1: bdk2m_comm (X4.1 X4.2), i_mon_2 (R25_i_mon_2.2 U2_i_mon_2.7)
I_ЦМ2: bdk2m_comm (X4.3 X4.4), i_mon_3 (R25_i_mon_3.2 U2_i_mon_3.7)
NetK1_2: bdk2m_comm (VD1.8), power_comm (K1.2 K1.7 K3.2 K3.7)
RX: bdk2m_comm (X2.17 X2.18), can_driver (U3.3)
TX: bdk2m_comm (X2.15 X2.16), can_driver (U3.2)
Vcc1: bdk2m_comm (X2.13 X2.14), can_driver (C14.2 U3.1)
Vcc2: bdk2m_comm (X3.11 X3.12), can_driver (C13.2 U3.8)
ВКЛ1(+): bdk2m_comm (X1.13 X1.14), power_comm (VD7.7 VD7.8)
ВКЛ1(-): bdk2m_comm (X1.15 X1.16), power_comm (VD9.15 VD9.16)
ВКЛ2(+): bdk2m_comm (X1.17 X1.18), power_comm (VD7.3 VD7.4)
ВКЛ2(-): bdk2m_comm (X1.19 X1.20), power_comm (VD9.11 VD9.12)
ВКЛ_АДИИ(-): bdk2m_comm (VT1.3), power_comm (K6.8 VD4.5 VD4.6)
ВЫКЛ1(+): bdk2m_comm (X2.3 X2.4), power_comm (VD7.5 VD7.6)
ВЫКЛ1(-): bdk2m_comm (X2.1 X2.2), power_comm (VD9.13 VD9.14)
ВЫКЛ2(-): bdk2m_comm (VT2.3), power_comm (VD9.9 VD9.10)
ВЫКЛ_АДИИ(-): bdk2m_comm (VT3.3), power_comm (K6.3 VD4.7 VD4.8)